# Altium schematic sheet BQ24123 Recharger.SchDoc
size A; SheetNumber: 1; SheetTotal: 1
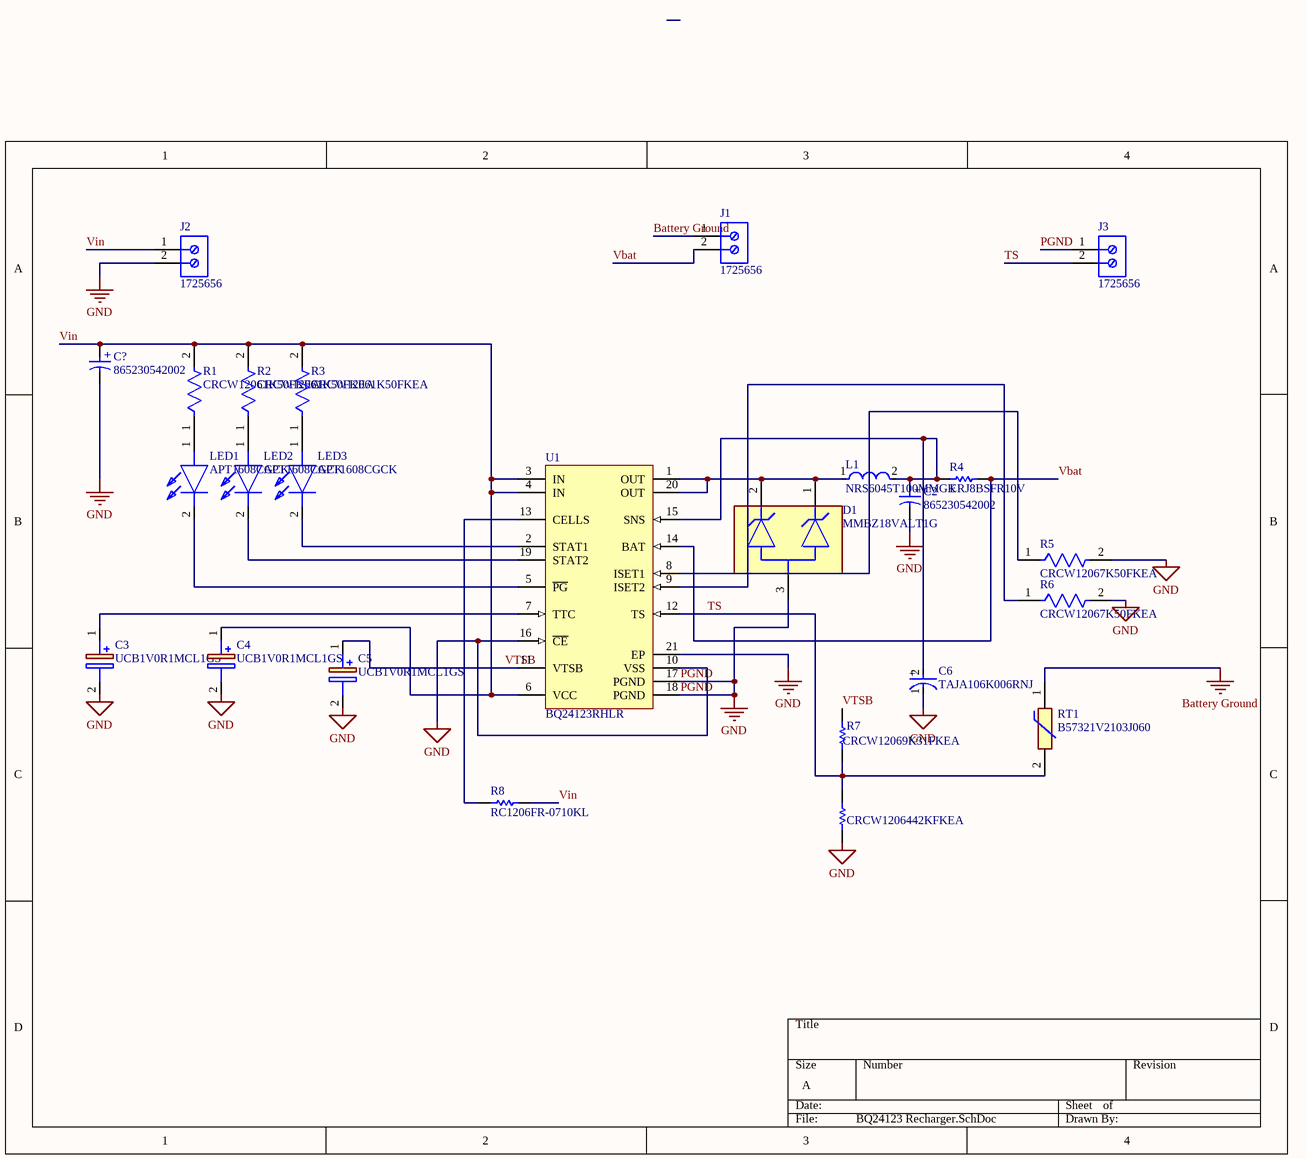
[diagram p0: BQ24123 Recharger.SchDoc]

## Parts
C2  865230542002  [WCAP-AS5H_D5H5.5]
C3  UCB1V0R1MCL1GS  [CAPAE430X730N]
C4  UCB1V0R1MCL1GS  [CAPAE430X730N]
C5  UCB1V0R1MCL1GS  [CAPAE430X730N]
C6  TAJA106K006RNJ  [FP-TAJA-MFG]
C?  865230542002  [WCAP-AS5H_D5H5.5]
D1  MMBZ18VALT1G  [FP-318-08-IPC_B]
J1  1725656  [PHOE-1725656-2]
J2  1725656  [PHOE-1725656-2]
J3  1725656  [PHOE-1725656-2]
L1  NRS6045T100MMGK  [FP-NR6045-MFG]
LED1  APT1608CGCK  [APT1608CGCK]
LED2  APT1608CGCK  [APT1608CGCK]
LED3  APT1608CGCK  [APT1608CGCK]
R1  CRCW12061K50FKEA  [FP-CRCW1206-e3-IPC_C]
R2  CRCW12061K50FKEA  [FP-CRCW1206-e3-IPC_C]
R3  CRCW12061K50FKEA  [FP-CRCW1206-e3-IPC_C]
R4  ERJ8BSFR10V  [RESC3216X70X50NL05T20]
R5  CRCW12067K50FKEA  [FP-CRCW1206-e3-IPC_C]
R6  CRCW12067K50FKEA  [FP-CRCW1206-e3-IPC_C]
R7  CRCW12069K31FKEA  [RESC3216X60X45ML10T20]
R8  RC1206FR-0710KL  [RESC3116X65X40ML10T20]
RT1  B57321V2103J060  [THRMC1608X90N]
U1  BQ24123RHLR  [RHL0020A_V]
  CRCW1206442KFKEA  [RESC3216X60X45NL10T20]

## Nets
Battery Ground: J1.1 RT1.1
PGND: C2.2(N) C3.2(-) C4.2(-) C5.2(-) C6.1(C) C?.2(N) D1.3(A) J2.2 J3.1 R5.2 R6.2 U1.10(VSS) U1.16(~{CE}) U1.17(PGND) U1.18(PGND) U1.21(EP) .2  [also labelled GND]
TS: J3.2 R7.1 RT1.2 U1.12(TS) .1
Vbat: J1.2 R4.2 U1.14(BAT)
Vin: C4.1(+) C?.1(P) J2.1 R1.2 R2.2 R3.2 R8.2 U1.3(IN) U1.4(IN) U1.6(VCC)
VTSB: C5.1(+) R7.2 U1.11(VTSB)
NetC2_1: C2.1(P) C6.2(A) L1.2 R4.1 U1.15(SNS)
NetC3_1: C3.1(+) U1.7(TTC)
NetD1_1: D1.1(1_CATHODE) D1.2(2_CATHODE) L1.1 U1.1(OUT) U1.20(OUT)
NetLED1_1: LED1.1(A) R1.1
NetLED1_2: LED1.2(K) U1.5(~{PG})
NetLED2_1: LED2.1(A) R2.1
NetLED2_2: LED2.2(K) U1.19(STAT2)
NetLED3_1: LED3.1(A) R3.1
NetLED3_2: LED3.2(K) U1.2(STAT1)
NetR5_1: R5.1 U1.8(ISET1)
NetR6_1: R6.1 U1.9(ISET2)
NetR8_1: R8.1 U1.13(CELLS)

## Notes on the sheet
- (in symbol CMP-03913-53914689-1) +
- (in symbol CMP-04424-000097-1) +

## Library data of the parts
C2 C? = CMP-03913-53914689-1: 865230542002 WCAP-AS5H Aluminum Electrolytic Capacitors; Voltage Rating (DC): 35V; Insulation Resistance: 10MΩ; Capacitance: 10µF; Tolerance: 20%; Ripple Current (AC): 25mA; Polarity: Polar; Leakage Current: 3.5µA; Life (Hours): 5000hours; Max Operating Temperature: 105°C; Width: 5.3mm; Mount: Surface Mount; Case/Package: Radial; Height: 5.5mm; Diameter: 5mm; Length: 5.5mm; Min Operating Temperature: -40°C; Voltage Rating: 35V; REACH SVHC: Unknown; Ripple Current: 25mA; Height - Seated (Max): 5.5118mm; Packaging: Tape & Reel (TR); NexarPartId: 53914689; RoHS: Compliant
C3-C5 = UCB1V0R1MCL1GS: Capacitor Polarised; Manufacturer_Name: Nichicon; Datasheet Link: http://www.nichicon.co.jp/english/products/pdfs/e-ucb.pdf; Height: 7.3mm; Manufacturer_Part_Number: UCB1V0R1MCL1GS; Mouser Part Number: 647-UCB1V0R1MCL1GS; Mouser Price/Stock: https://www.mouser.co.uk/ProductDetail/Nichicon/UCB1V0R1MCL1GS/?qs=Wu4QelNNmeOHrkSeva4QtA%3D%3D
C6 = CMP-04424-000097-1: 10uF 6.3V  ±10% 4Ω 1206  SMD Tantalum Capacitor; Leakage Current: 600nA; Q Factor: 6; Polarity: Polar; ESR (Equivalent Series Resistance): 4R; Dissipation Factor: 6%; Tolerance: 20%; Lead Free: Lead Free; Min Operating Temperature: -55°C; Case/Package: 1206; Voltage Rating (DC): 6.3V; Capacitance: 10uF; Mount: Surface Mount; Termination: SMD/SMT; Depth: 1.6mm; Height: 1.6mm; Voltage: 6.3V; Features: General Purpose; Series: TAJ; Voltage Rating: 6.3V; Package Quantity: 1; Max Operating Temperature: 125°C; Width: 1.6mm; Length: 3.2mm; Construction: Flat; REACH SVHC: No SVHC; Case Code (Imperial): 1206; Radiation Hardening: No; RoHS Compliant: Yes; Dielectric Material: Tantalum; Height - Seated (Max): 0.071inch; Case Code (Metric): 3216; Packaging: Tape and Reel
D1 = CMP-1061-00637-2: TVS DIODE 14.5V 25V SOT23-3; Power Dissipation: 40W; Element Configuration: Common Anode; Number of Channels: 2; Direction: Unidirectional; Max Power Dissipation: 225mW; Max Breakdown Voltage: 18.9V; Leakage Current: 50nA; Reverse Breakdown Voltage: 17.1V; Voltage Rating (DC): 18V; Max Surge Current: 1.6A; Power Line Protection: No; ESD Protection: Yes; Test Current: 1mA; Packaging: Tape and Reel; Working Voltage: 14.5V; Min Operating Temperature: -55°C; Package Quantity: 1; REACH SVHC: No SVHC; Number of Pins: 3; Width: 1.4mm; Peak Pulse Power: 40W; Clamping Voltage: 25V; Operating Supply Voltage: 14.5V; Number of Unidirectional Channels: 2; Polarity: Unidirectional; Height: 1.01mm; Reverse Standoff Voltage: 14.5V; Radiation Hardening: No; Min Breakdown Voltage: 17.1V; Max Operating Temperature: 150°C; Number of Elements: 2; Length: 2.9mm; Case/Package: SOT-23-3; Depth: 1.3mm; Max Reverse Leakage Current: 50nA; Breakdown Voltage: 17.1V; Contact Plating: Tin; Lead Free: Lead Free; Termination: SMD/SMT; Peak Pulse Current: 1.6A; Composition: Zener
J1-J3 = CMP-2000-05299-1: Male Header, Pitch 2.54 mm, 1 x 2 Position, Height 9 mm, Tail Length 3.5 mm; Manufacturer: Phoenix Contact; Number of contacts: 2; Content: 250pc(s); Pitch: 2.54mm; Industrial packaging: Yes; Colour: Green; Manufacturer part No.: 1725656; Type: MPT0,5/2-2,54; Datasheet URL: http://datasheet.octopart.com/1725656-Phoenix-Contact-datasheet-5302866.pdf; Manufacturer URL: http://www.phoenixcontact.com/; Datasheet Version: Apr-08
L1 = CMP-14484-001321-1: Shielded Wirewound Inductor 10uH 20% 2.8A 59.8mΩ SMD; DC Resistance (DCR): 59.8mR; Test Frequency: 100kHz; Self Resonant Frequency: 12MHz; Core Material: Ferrite; Max DC Current: 3.1A; RMS Current (Irms): 2.4A; Inductance: 10uH; Length: 6mm; Height - Seated (Max): 0.177inch; Series: NRS; Min Operating Temperature: -25°C; Tolerance: 20%; Radiation Hardening: No; Halogen Free: Halogen Free; Shielding: Shielded; Resistor Type: Wirewound; Case/Package: Nonstandard; Number of Pins: 2; Package Quantity: 1500; Width: 0.236inch; Depth: 6.2mm; Max Operating Temperature: 125°C; Packaging: Tape and Reel; Lead Free: Lead Free; Mount: Surface Mount; RoHS Compliant: Yes; Height: 4.5mm; Lead Pitch: 4.7mm; Saturation Current: 3.1A; Termination: SMD/SMT; Current Rating: 2.4A; Inductance Tolerance: 20%
LED1-LED3 = APT1608CGCK: LED; Manufacturer_Name: Kingbright; Datasheet Link: https://componentsearchengine.com/Datasheets/1/APT1608CGCK.pdf; Height: 0.75mm; Manufacturer_Part_Number: APT1608CGCK; Mouser Part Number: 604-APT1608CGCK; Mouser Price/Stock: https://www.mouser.co.uk/ProductDetail/Kingbright/APT1608CGCK?qs=VdjlWU%2FzoOFSew86JUt6QA%3D%3D; Arrow Part Number: APT1608CGCK; Arrow Price/Stock: https://www.arrow.com/en/products/apt1608cgck/kingbright?region=nac
R1-R3 = CMP-02407-002229-1: RES Thick Film, 1.5kΩ, 1%, 0.25W, 100ppm/°C, 1206; Voltage Rating (DC): 200V; Power Rating: 250mW; Resistance: 1.5kR; Depth: 1.6mm; Case/Package: 1206; Packaging: Tape and Reel; Military Standard: Not; Radiation Hardening: No; Features: Automotive AEC-Q200; Number of Terminations: 2; Case Code (Imperial): 1206; Width: 0.063inch; Voltage Rating: 200V; Tolerance: 1%; Max Operating Temperature: 155°C; Weight: 0.000353oz; Package Quantity: 10; Temperature Coefficient: 100ppm/°C; Lead Free: Lead Free; Height: 0.024inch; Max Power Dissipation: 250mW; Termination: SMD/SMT; Length: 3.2mm; Contact Plating: Tin; Composition: Thick Film; Min Operating Temperature: -55°C; Case Code (Metric): 3216
R4 = CMP-2003-00761-1: Manufacturer: Panasonic; Part Number: ERJ8BSFR10V
R5 R6 = CMP-2003-02388-2: RES Thick Film, 7.5kΩ, 1%, 0.25W, 100ppm/°C, 1206; Working Voltage: 200V; Power Rating: 250mW; Resistance: 7.5kR; Height: 0.55mm; Military Standard: Not; Min Operating Temperature: -55°C; Packaging: Tape and Reel; Case Code (Imperial): 1206; Temperature Coefficient: 100ppm/°C; Package Quantity: 10; Width: 0.063inch; Length: 3.2mm; Series: CRCW; Resistor Type: Thick Film; Depth: 1.6mm; Radiation Hardening: No; Voltage Rating: 200V; Case Code (Metric): 3216; Case/Package: 1206; Resistance Tolerance: 1%; Technology: THICK FILM; Lead Free: Lead Free; Termination: SMD/SMT; Features: Automotive AEC-Q200; Weight: 0.000353oz; Construction: Rectangular; Tolerance: 1%; RoHS Compliant: Yes; Voltage Rating (DC): 200V; Contact Plating: Tin; Max Operating Temperature: 155°C; Max Power Dissipation: 250mW; Number of Terminations: 2
R7 = CMP-2003-02443-1: Manufacturer: Vishay Dale; Part Number: CRCW12069K31FKEA
R8 = CMP-1014-00623-2: Chip Resistor, 10 KOhm, +/- 1%, 0.25 W, -55 to 155 degC, 1206 (3216 Metric), RoHS, Tape and Reel; Manufacturer: Yageo; Voltage Rating: 200V; Resistance: 10KOhm; Temperature Coefficient: 100ppm/degreesC; Power Rating: 250mW; Packaging: TapeandReel; Termination: SMD/SMT; REACH SVHC: Unknown; Tolerance: 1%; Height: 0.55mm; Composition: ThickFilm; Max Operating Temperature: 155degC; Datasheet Version: Rev. 5, 10/2016; Lead Free: LeadFree; Case Code (Metric): 3216; Depth: 1.6mm; Package Quantity: 5000; RoHSCompliant: true; Military Standard: Not; Case/Package: 1206; Case Code (Imperial): 1206; Min Operating Temperature: -55degC; Datasheet URL: http://www.yageo.com/NewPortal/yageodocoutput?fileName=/pdf/R-Chip/PYu-RC_Group_51_RoHS_L_5.pdf; Length: 3.1mm; Manufacturer URL: http://www.yageo.com/; Package Reference: 1206.0; Width: 1.6mm; Package Description: 2-Pin Surface Mount Device, Body 3.1 x 1.6 mm
RT1 = B57321V2103J060: Thermistor; Manufacturer_Name: TDK; Datasheet Link: https://product.tdk.com/system/files/dam/doc/product/sensor/ntc/chip-ntc-thermistor/data_sheet/50/db/ntc/ntc_smd_standard_series_0603.pdf; Height: 0.9mm; Manufacturer_Part_Number: B57321V2103J060; Mouser Part Number: 871-B57321V2103J060; Arrow Part Number: B57321V2103J060; Arrow Price/Stock: https://www.arrow.com/en/products/b57321v2103j060/epcos-tdk
U1 = CMP-0321-00131-2: Synchronous Switch-Mode 2-Cell Li-Ion Charger with 2 A FET, Enhanced EMI Performance, 4.3 V, -40 to 85 degC, 20-pin QFN (RHL), Green (RoHS & no Sb/Br); Manufacturer: Texas Instruments; Over Voltage Protection: N; Li-Polymer: Y; SubFamily: Battery Charge Management; Vin(Min)(V): 4.3; Mounting Technology: Surface Mount; DatasheetVersion: SLUS688G; PartNumber: BQ24123RHLR; Eco-Plan: Green (RoHS & no Sb/Br); Lead Acid: N; Li-Ion: Y; ComponentLink1Description: Datasheet; NiMH: N; PackageVersion: revJ, Dec-2011; PackageReference: RHL0020A; PackageDescription: 20-Leads Plastic Quad Flatpack No-Lead, 4.5 x 3.5 x 0.9 mm Body, 0.5 mm Pitch, Exposed Pad; ComponentLink1URL: http://www.ti.com/general/docs/lit/getliterature.tsp?genericPartNumber=BQ24123&fileType=pdf; NiCd: N
 = CMP-2003-02197-1: Manufacturer: Vishay Dale; Part Number: CRCW1206442KFKEA